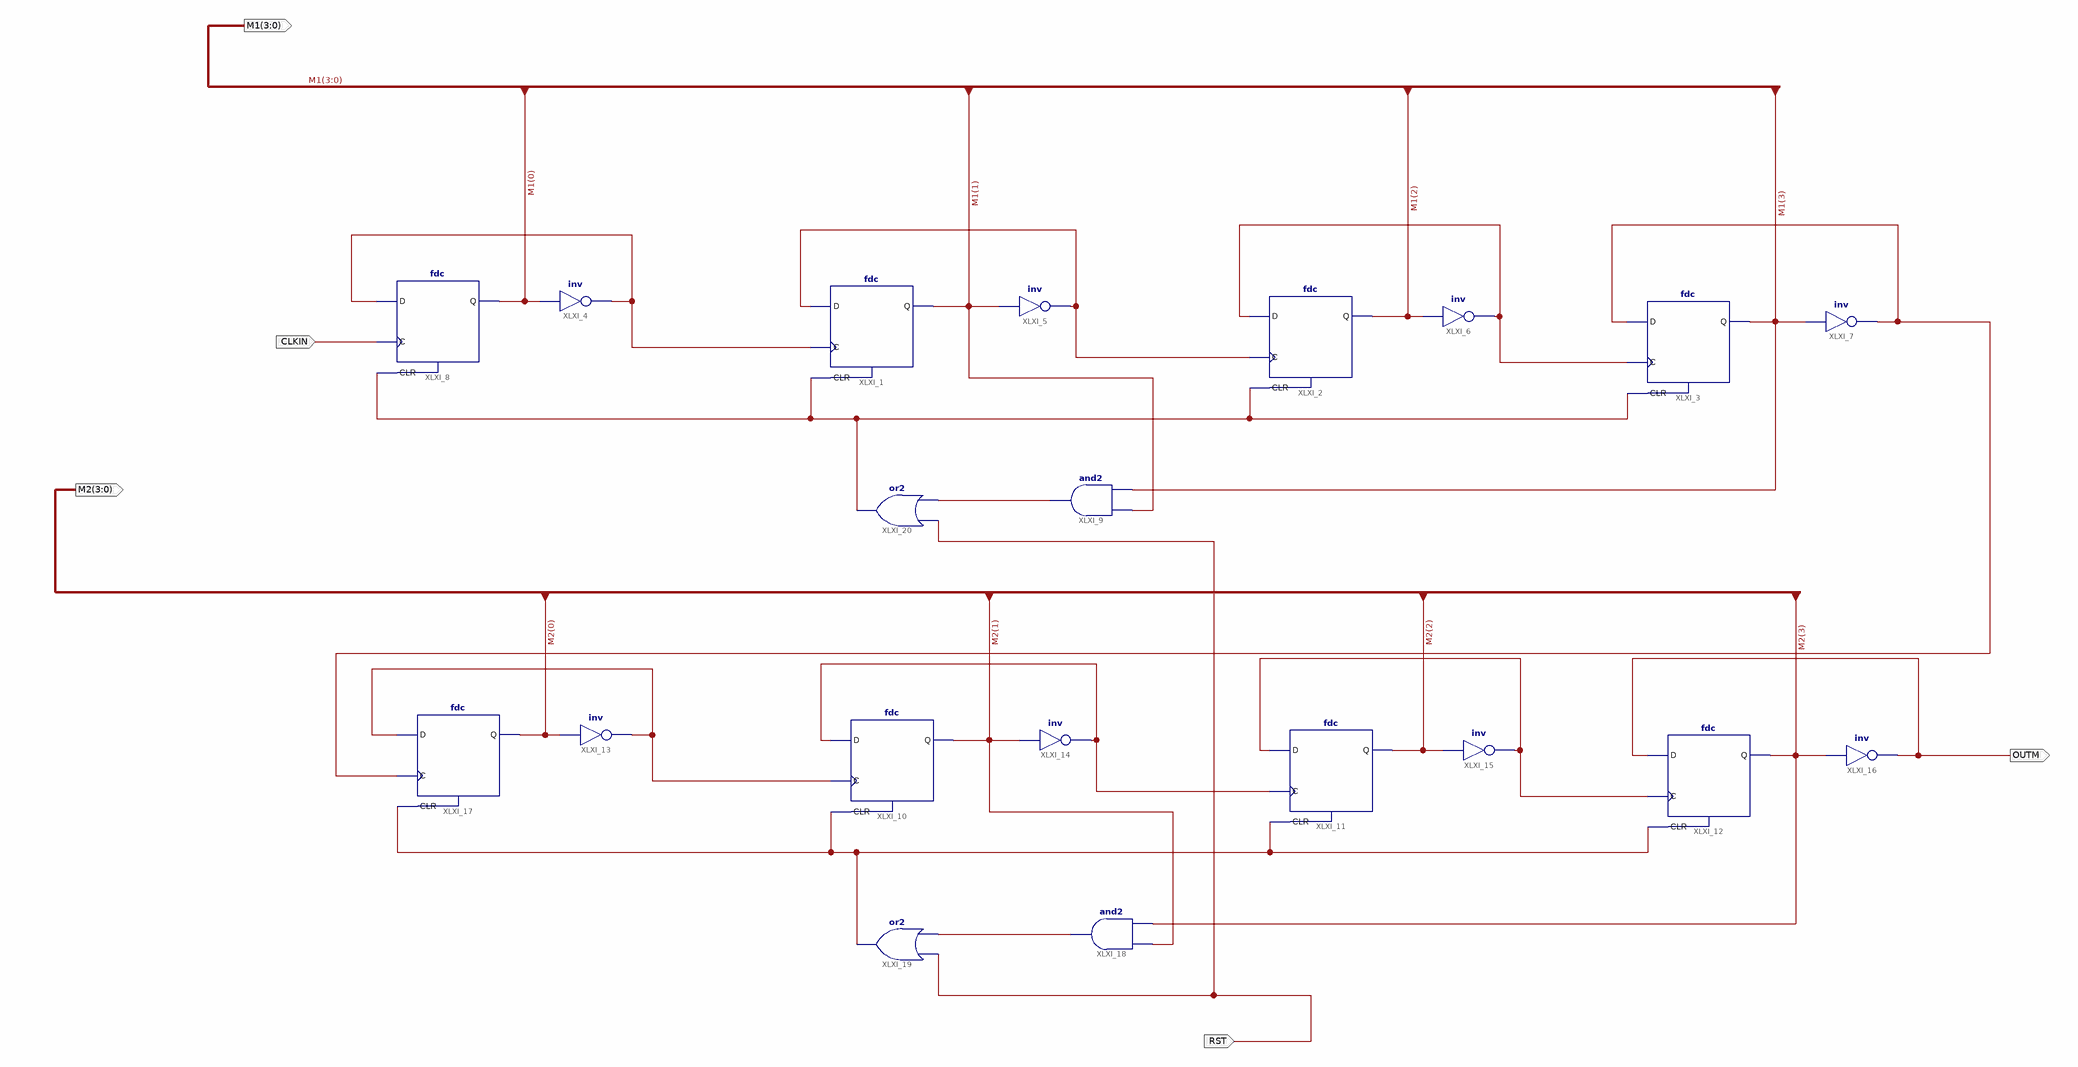
[diagram p0: schematic sheet 1]
// Xilinx ISE schematic MinuteCounter.sch (spartan6) as structural Verilog: 20 symbols, 5 ports
module MinuteCounter (
  input  CLKIN,
  input  RST,
  output OUTM,
  output [3:0] M2,
  output [3:0] M1
);

  wire CLKOUT, XLXN_5, XLXN_6, XLXN_7, XLXN_12, XLXN_24, XLXN_28, XLXN_29, XLXN_31, XLXN_32, XLXN_33;

  fdc XLXI_1 (.C(XLXN_12), .CLR(XLXN_31), .D(XLXN_5), .Q(M1[1]));
  fdc XLXI_2 (.C(XLXN_5), .CLR(XLXN_31), .D(XLXN_6), .Q(M1[2]));
  fdc XLXI_3 (.C(XLXN_6), .CLR(XLXN_31), .D(CLKOUT), .Q(M1[3]));
  not XLXI_4 (XLXN_12, M1[0]);
  not XLXI_5 (XLXN_5, M1[1]);
  not XLXI_6 (XLXN_6, M1[2]);
  not XLXI_7 (CLKOUT, M1[3]);
  fdc XLXI_8 (.C(CLKIN), .CLR(XLXN_31), .D(XLXN_12), .Q(M1[0]));
  and XLXI_9 (XLXN_33, M1[3], M1[1]);
  fdc XLXI_10 (.C(XLXN_28), .CLR(XLXN_29), .D(XLXN_24), .Q(M2[1]));
  fdc XLXI_11 (.C(XLXN_24), .CLR(XLXN_29), .D(XLXN_7), .Q(M2[2]));
  fdc XLXI_12 (.C(XLXN_7), .CLR(XLXN_29), .D(OUTM), .Q(M2[3]));
  not XLXI_13 (XLXN_28, M2[0]);
  not XLXI_14 (XLXN_24, M2[1]);
  not XLXI_15 (XLXN_7, M2[2]);
  not XLXI_16 (OUTM, M2[3]);
  fdc XLXI_17 (.C(CLKOUT), .CLR(XLXN_29), .D(XLXN_28), .Q(M2[0]));
  and XLXI_18 (XLXN_32, M2[3], M2[1]);
  or XLXI_19 (XLXN_29, XLXN_32, RST);
  or XLXI_20 (XLXN_31, XLXN_33, RST);
endmodule
